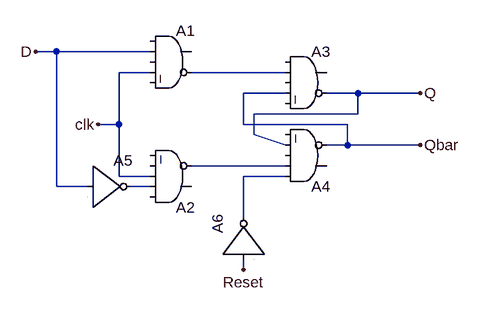
[diagram p0: schematic d-flip-flop.asc]
d-flip-flop.asc, the LTspice schematic file:
Version 4
SHEET 1 880 680
WIRE -48 48 -80 48
WIRE 96 48 -48 48
WIRE 96 80 48 80
WIRE 304 80 160 80
WIRE 304 112 240 112
WIRE 416 112 368 112
WIRE 512 112 416 112
WIRE 416 144 416 112
WIRE 416 144 256 144
WIRE 48 160 48 80
WIRE 48 160 16 160
WIRE 240 160 240 112
WIRE 400 160 240 160
WIRE 256 176 256 144
WIRE 304 192 256 176
WIRE 400 192 400 160
WIRE 400 192 368 192
WIRE 512 192 400 192
WIRE 304 224 160 224
WIRE 48 240 48 160
WIRE 96 240 48 240
WIRE 304 240 240 240
WIRE -48 256 -48 48
WIRE 0 256 -48 256
WIRE 96 256 64 256
WIRE 240 304 240 240
WIRE 240 384 240 368
FLAG 512 112 Q
FLAG 512 192 Qbar
FLAG 16 160 clk
FLAG -80 48 D
FLAG 240 384 Reset
SYMBOL Digital\\and 128 0 R0
SYMATTR InstName A1
SYMBOL Digital\\and 128 304 M180
SYMATTR InstName A2
SYMBOL Digital\\and 336 32 R0
SYMATTR InstName A3
SYMBOL Digital\\and 336 272 M180
SYMATTR InstName A4
SYMBOL Digital\\inv 0 192 R0
SYMATTR InstName A5
SYMBOL Digital\\inv 176 368 R270
SYMATTR InstName A6

The netlist it stands for:
* d-flip-flop.asc
A1 0 D 0 clk 0 N001 0 0 AND
A2 0 N004 clk 0 0 N002 0 0 AND
A3 0 N001 0 Qbar 0 Q 0 0 AND
A4 N003 N002 0 Q 0 Qbar 0 0 AND
A5 D 0 0 0 0 N004 0 0 BUF
A6 Reset 0 0 0 0 N003 0 0 BUF
.backanno
.end